# Altium project LED_Driver.PrjPcb
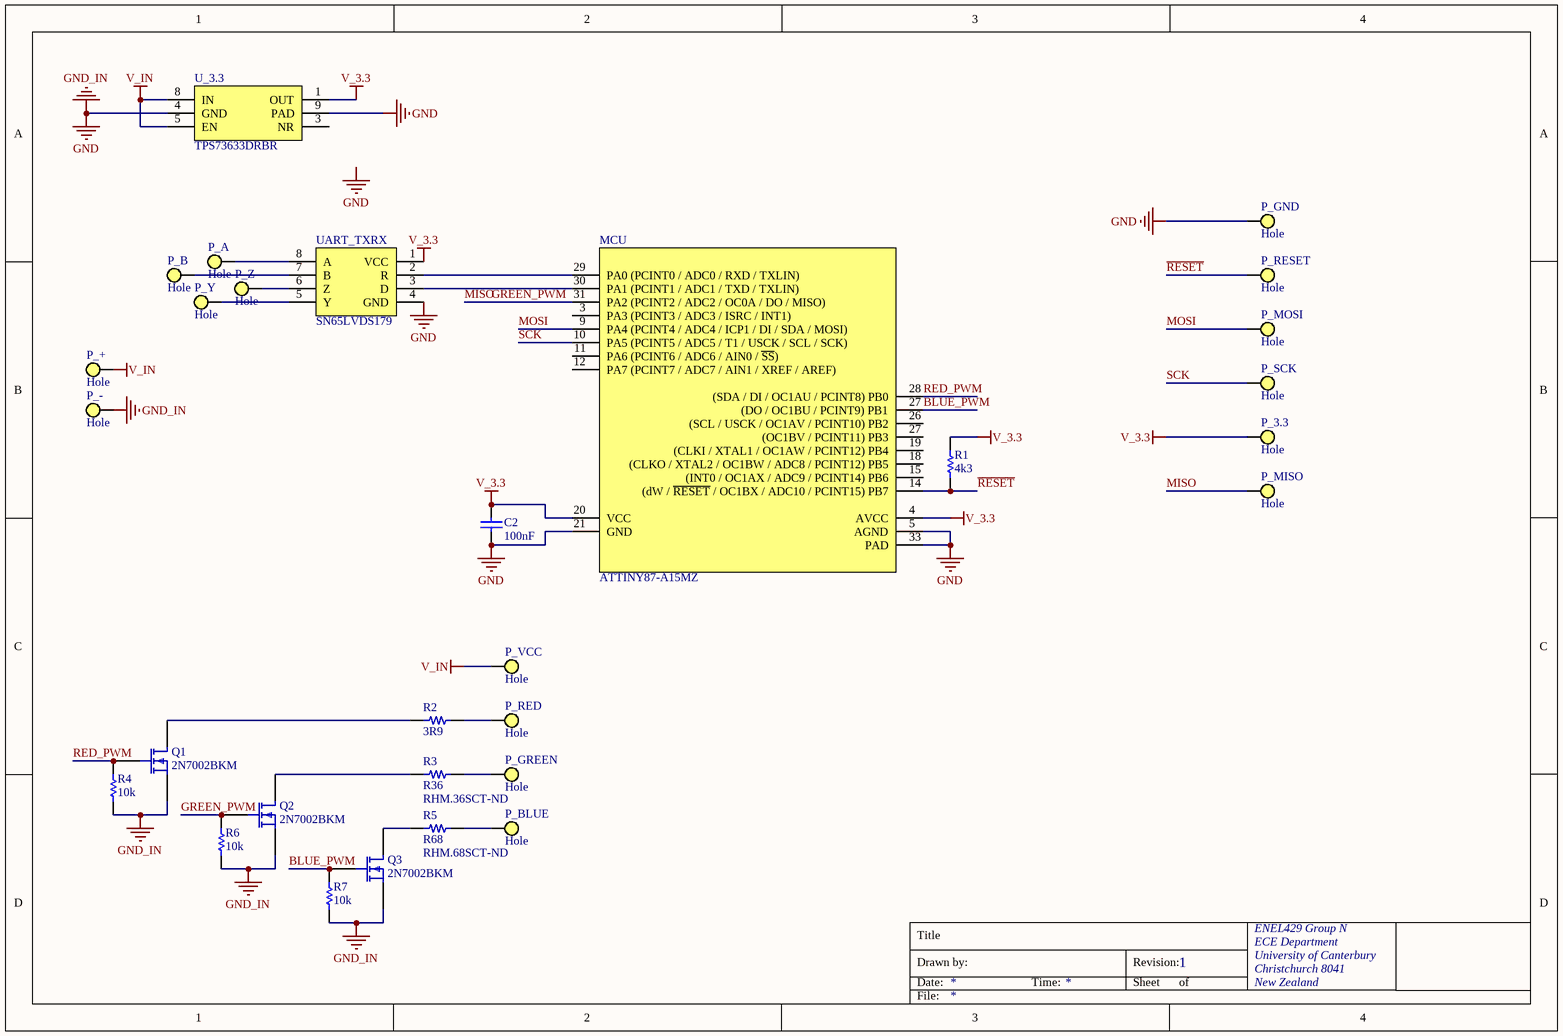
[diagram p0: LED_Driver.SchDoc]
1 sheet, 30 parts. Net scope: global (net labels, ports and power ports of the same name join across sheets).
Board file: LED_Driver.PcbDoc

## Sheet LED_Driver.SchDoc
size A4; Organization: ENEL429 Group N; Address1: ECE Department; Address2: University of Canterbury; Address3: Christchurch 8041; Address4: New Zealand; Revision: 1

### Parts
C2  100nF  [0603]
MCU  ATTINY87-A15MZ  [QFN50P500X500X100-32N]
P_3.3  Hole  [Hole]
P_+  Hole  [Hole]
P_-  Hole  [Hole]
P_A  Hole  [Hole]
P_B  Hole  [Hole]
P_BLUE  Hole  [Hole]
P_GND  Hole  [Hole]
P_GREEN  Hole  [Hole]
P_MISO  Hole  [Hole]
P_MOSI  Hole  [Hole]
P_RED  Hole  [Hole]
P_RESET  Hole  [Hole]
P_SCK  Hole  [Hole]
P_VCC  Hole  [Hole]
P_Y  Hole  [Hole]
P_Z  Hole  [Hole]
Q1  2N7002BKM  [SOT883 / SC-101]
Q2  2N7002BKM  [SOT883 / SC-101]
Q3  2N7002BKM  [SOT883 / SC-101]
R1  4k3  [0603]
R2  3R9  [1210]
R3  R36  Supplier Part Number 1: RHM.36SCT-ND  [1210]
R4  10k  [0603]
R5  R68  Supplier Part Number 1: RHM.68SCT-ND  [1210]
R6  10k  [0603]
R7  10k  [0603]
U_3.3  TPS73633DRBR  [TI - DRB / QFN65P300X300X100-8L]
UART_TXRX  SN65LVDS179  [TI - DGK / TSOP65P490X110-8L]

### Nets
GND: C2.1 MCU.5(AGND) MCU.21(GND) MCU.33(PAD) P_-.1 P_GND.1 Q1.2(S) Q2.2(S) Q3.2(S) R4.1 R6.1 R7.1 U_3.3.4(GND) U_3.3.9(PAD) UART_TXRX.4(GND)  [also labelled GND_IN]
V_3.3: C2.2 MCU.4(AVCC) MCU.20(VCC) P_3.3.1 R1.2 U_3.3.1(OUT) UART_TXRX.1(VCC)
V_IN: P_+.1 P_VCC.1 U_3.3.5(EN) U_3.3.8(IN)
BLUE_PWM: MCU.27((DO_/_OC1BU_/_PCINT9)_PB1) Q3.1(G) R7.2
GREEN_PWM: MCU.31(PA2_(PCINT2_/_ADC2_/_OC0A_/_DO_/_MISO)) P_MISO.1 Q2.1(G) R6.2  [also labelled MISO]
MOSI: MCU.9(PA4_(PCINT4_/_ADC4_/_ICP1_/_DI_/_SDA_/_MOSI)) P_MOSI.1
~{RESET}: MCU.14((dW_/_~{RESET}_/_OC1BX_/_ADC10_/_PCINT15)_PB7) P_RESET.1 R1.1
RED_PWM: MCU.28((SDA_/_DI_/_OC1AU_/_PCINT8)_PB0) Q1.1(G) R4.2
SCK: MCU.10(PA5_(PCINT5_/_ADC5_/_T1_/_USCK_/_SCL_/_SCK)) P_SCK.1
NetMCU_29: MCU.29(PA0_(PCINT0_/_ADC0_/_RXD_/_TXLIN)) UART_TXRX.2(R)
NetMCU_30: MCU.30(PA1_(PCINT1_/_ADC1_/_TXD_/_TXLIN)) UART_TXRX.3(D)
NetP_A_1: P_A.1 UART_TXRX.8(A)
NetP_B_1: P_B.1 UART_TXRX.7(B)
NetP_BLUE_1: P_BLUE.1 R5.2
NetP_GREEN_1: P_GREEN.1 R3.2
NetP_RED_1: P_RED.1 R2.2
NetP_Y_1: P_Y.1 UART_TXRX.5(Y)
NetP_Z_1: P_Z.1 UART_TXRX.6(Z)
NetQ1_3: Q1.3(D) R2.1
NetQ2_3: Q2.3(D) R3.1
NetQ3_3: Q3.3(D) R5.1

Not connected (* = marked no-connect by the designer): MCU 3(PA3_(PCINT3_/_ADC3_/_ISRC_/_INT1)) 11(PA6_(PCINT6_/_ADC6_/_AIN0_/_~{SS})) 12(PA7_(PCINT7_/_ADC7_/_AIN1_/_XREF_/_AREF)) 15((INT0_/_OC1AX_/_ADC9_/_PCINT14)_PB6) 18((CLKO_/_XTAL2_/_OC1BW_/_ADC8_/_PCINT12)_PB5) 19((CLKI_/_XTAL1_/_OC1AW_/_PCINT12)_PB4) 26((SCL_/_USCK_/_OC1AV_/_PCINT10)_PB2); U_3.3 3(NR)

### Notes on the sheet
- Labels drawn without touching a wire or pin: GND
- Title
- Drawn by:
- Date:
- Time:
- Revision:
- Sheet
- of
- File:

### Library data of the parts
C2 = CP_100nF 0603: CAP CER .10UF 50V X5R 0603; Manufacturer: Taiyo Yuden; Manufacturer PN: UMK107B7104KA-T; LatestRevisionDate: 29 May 08; Supplier 1: Digi-Key; Supplier Part Number 1: 478-6206-1-ND; Value: 100nF; Part Number: CP_100nF 0603; Component Kind: Standard; Component Type: Standard; Designator: CP_100nF 0603; Pin Count: 2; Signal Integrity: Cap; Simulation: CAP
MCU = ATTINY87-A15MZ: MCU AVR 8K FLASH 15MHZ 32QFN; Manufacturer: Atmel; Core Size: 8-Bit; Speed: 16MHz; Connectivity: I²C, LIN, SPI, UART/USART, USI; Peripherals: Brown-out Detect/Reset, POR, PWM, Temp Sensor, WDT; Number of I /O: 16; Program Memory Size: 8KB (4K x 16); EEPROM Size: 512 x 8; Voltage - Supply (Vcc/Vdd): 2.7 V ~ 5.5 V; Data Converters: A/D 11x10b; Oscillator Type: Internal; Supplier 1: Digi-Key; Manufacturer Part Number: ATTINY87-A15MZ; RoHS: RoHS Compliant; Category: Integrated Circuits (ICs); Core Processor: AVR; Program Memory Type: FLASH; RAM Size: 512 x 8; Operating Temperature: -40°C ~ 125°C; Package / Case: 32-VFQFN Exposed Pad; Packaging: Cut Tape (CT); Supplier Part Number 1: ATTINY87-A15MZCT-ND
P_3.3 P_+ P_- P_A P_B P_BLUE P_GND P_GREEN P_MISO P_MOSI P_RED P_RESET P_SCK P_VCC P_Y P_Z = Solder_Hole: A hole to solder a wire to.
Q1-Q3 = 2N7002BKM,315: MOSFET N-CH 60V 450MA SOT883; Manufacturer: NXP Semiconductors; FET Type: MOSFET N-Channel, Metal Oxide; FET Feature: Logic Level Gate; Rds On (Max) @ Id, Vgs: 1.6 Ohm @ 500mA, 10V; Vgs(th) (Max) @ Id: 2.1V @ 250µA; Gate Charge (Qg) @ Vgs: 0.6nC @ 4.5V; Input Capacitance (Ciss) @ Vds: 50pF @ 10V; Power - Max: 360mW; Supplier 1: Digi-Key; Manufacturer Part Number: 2N7002BKM,315; RoHS: RoHS Compliant; Category: Discrete Semiconductor Products; Drain to Source Voltage (Vdss): 60V; Current - Continuous Drain (Id) @ 25° C: 450mA; Mounting Type: Surface Mount; Package / Case: SC-101, SOT-883; Supplier Device Package: SC-101; Packaging: Cut Tape (CT); ComponentLink1URL: http://www.nxp.com/documents/data_sheet/2N7002BKM.pdf; ComponentLink1Description: http://www.nxp.com/documents/data_sheet/2N7002BKM.pdf; Supplier Part Number 1: 568-5976-1-ND
R1 = RS_4k3 0603: RES 4.3K OHM 1/10W 5% 0603 SMD; Manufacturer: Yageo; Manufacturer PN: RC0603JR-074K3L; LatestRevisionDate: 6 May 2011; Supplier 1: Digi-Key; Supplier Part Number 1: 311-4.3KGRTR-ND; Value: 4k3; Part Number: RS_4k3 0603; Component Kind: Standard; Component Type: Standard; Designator: RS_4k3 0603; Pin Count: 2; Signal Integrity: Res; Simulation: RESISTOR
R2 = CRCW12103R90JNEA: RES 3.9 OHM 1/2W 5% 1210 SMD; Manufacturer: Vishay/Dale; Resistance (Ohms): 3.9; Power (Watts): 0.5W, 1/2W; Temperature Coefficient: ±200ppm/°C; Supplier 1: Digi-Key; Manufacturer Part Number: CRCW12103R90JNEA; RoHS: RoHS Compliant; Category: Resistors; Stock 1: 13236; Pricing 1: 10=0.261, 50=0.1406, 200=0.08075, 1000=0.0551 (USD); Composition: Thick Film; Features: -; Tolerance: ±5%; Size / Dimension: 0.126" L x 0.098" W (3.20mm x 2.50mm); Height: 0.024" (0.60mm); Number of Terminations: 2; Packaging: Cut Tape (CT); Package / Case: 1210 (3225 Metric); ComponentLink1URL: http://www.vishay.com/doc?20035; ComponentLink1Description: http://www.vishay.com/doc?20035; Supplier Part Number 1: 541-3.9VCT-ND
R3 = MCR25JZHFLR360: RES .36 OHM 1/2W 1% 1210 SMD; Manufacturer: Rohm Semiconductor; Resistance (Ohms): 0.36; Power (Watts): 0.5W, 1/2W; Temperature Coefficient: ±200ppm/°C; Supplier 1: Digi-Key; Manufacturer Part Number: MCR25JZHFLR360; RoHS: RoHS Compliant; Category: Resistors; Composition: Thick Film; Features: -; Tolerance: ±1%; Size / Dimension: 0.126" L x 0.098" W (3.20mm x 2.50mm); Height: 0.028" (0.70mm); Number of Terminations: 2; Packaging: Cut Tape (CT); Package / Case: 1210 (3225 Metric); ComponentLink1URL: http://www.rohm.com/products/databook/r/pdf/mcr25_ttk.pdf; ComponentLink1Description: http://www.rohm.com/products/databook/r/pdf/mcr25_ttk.pdf
R4 R6 R7 = RS_10k 0603: RES 10.0K OHM 1/10W 1% 0603 SMD; Manufacturer: Yageo; Manufacturer PN: RC0603FR-0710KL; LatestRevisionDate: 29 May 08; Supplier 1: Digi-Key; Supplier Part Number 1: 311-10.0KHRTR-ND; Value: 10k; Part Number: RS_10k 0603; Component Kind: Standard; Component Type: Standard; Designator: RS_10k 0603; Pin Count: 2; Signal Integrity: Res; Simulation: RESISTOR
R5 = MCR25JZHFLR680: RES .68 OHM 1/2W 1% 1210 SMD; Manufacturer: Rohm Semiconductor; Resistance (Ohms): 0.68; Power (Watts): 0.5W, 1/2W; Temperature Coefficient: ±200ppm/°C; Supplier 1: Digi-Key; Manufacturer Part Number: MCR25JZHFLR680; RoHS: RoHS Compliant; Category: Resistors; Composition: Thick Film; Features: -; Tolerance: ±1%; Size / Dimension: 0.126" L x 0.098" W (3.20mm x 2.50mm); Height: 0.028" (0.70mm); Number of Terminations: 2; Packaging: Cut Tape (CT); Package / Case: 1210 (3225 Metric); ComponentLink1URL: http://www.rohm.com/products/databook/r/pdf/mcr25_ttk.pdf; ComponentLink1Description: http://www.rohm.com/products/databook/r/pdf/mcr25_ttk.pdf
U_3.3 = TPS73633DRBR: IC LDO REG 400MA NO CAP 8-SON; Manufacturer: Texas Instruments; Regulator Topology: Positive Fixed; Voltage - Output: 3.3V; Voltage - Input: Up to 5.5V; Voltage - Dropout (Typical): 0.075V @ 400mA; Number of Regulators: 1; Current - Output: 400mA (Max); Supplier 1: Digi-Key; Manufacturer Part Number: TPS73633DRBR; RoHS: RoHS Compliant; Category: Integrated Circuits (ICs); Stock 1: 6005; Pricing 1: 1=3.15, 25=2.43, 100=2.205, 250=1.98, 500=1.71, 1000=1.44 (USD); Current - Limit (Min): 400mA; Operating Temperature: -40°C ~ 125°C; Mounting Type: Surface Mount; Package / Case: 8-VDFN Exposed Pad; Supplier Device Package: 8-SON Exposed Pad (3x3); Packaging: Cut Tape (CT); ComponentLink1URL: http://focus.ti.com/lit/ds/symlink/tps73601.pdf; ComponentLink1Description: http://focus.ti.com/lit/ds/symlink/tps73601.pdf; Supplier Part Number 1: 296-17884-1-ND
UART_TXRX = SN65LVDS179DGK: High-Speed Differential Line Driver and Receiver; Manufacturer: Texas Instruments; Description: IC HS DIFF LINE DRVR/RCVR 8-MSOP; Number of Drivers/Receivers: 1/1; Protocol: LVDS; Voltage - Supply: 3 V ~ 3.6 V; Supplier 1: Digi-Key; Manufacturer Part Number: SN65LVDS179DGK; RoHS: RoHS Compliant; Category: Integrated Circuits (ICs); Stock 1: 1279; Pricing 1: 1=3.53, 25=2.8352, 100=2.583, 250=2.331, 500=2.0916, 1000=1.764, 2500=1.6758, 5000=1.6065, 10000=1.5624 (USD); Type: Transceiver; Mounting Type: Surface Mount; Package / Case: 8-TSSOP, 8-MSOP (0.118", 3.00mm Width); Supplier Device Package: 8-MSOP; Packaging: Tube; ComponentLink1URL: http://focus.ti.com/lit/ds/symlink/sn65lvds050.pdf; ComponentLink1Description: http://focus.ti.com/lit/ds/symlink/sn65lvds050.pdf; Supplier Part Number 1: 296-6918-5-ND